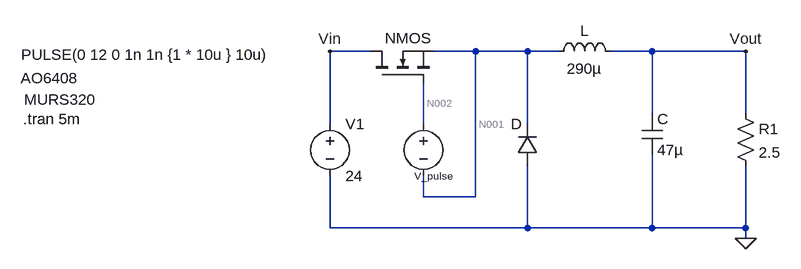
[diagram p0: schematic Buck.asc]
Buck.asc, the LTspice schematic file:
Version 4
SHEET 1 880 680
WIRE 32 32 -32 32
WIRE 192 32 128 32
WIRE 272 32 192 32
WIRE 320 32 272 32
WIRE 464 32 400 32
WIRE 608 32 464 32
WIRE 464 128 464 32
WIRE 608 128 608 32
WIRE -32 144 -32 32
WIRE 112 144 112 80
WIRE 272 144 272 32
WIRE 112 256 112 224
WIRE 192 256 192 32
WIRE 192 256 112 256
WIRE -32 304 -32 224
WIRE 272 304 272 208
WIRE 272 304 -32 304
WIRE 464 304 464 192
WIRE 464 304 272 304
WIRE 608 304 608 208
WIRE 608 304 464 304
WIRE 608 320 608 304
FLAG 608 320 0
FLAG 608 32 Vout
FLAG -32 32 Vin
SYMBOL voltage -32 128 R0
WINDOW 123 0 0 Left 0
WINDOW 39 0 0 Left 0
SYMATTR InstName V1
SYMATTR Value 24
SYMBOL voltage 112 128 R0
WINDOW 0 -14 96 Left 1
WINDOW 3 -619 -91 Left 2
WINDOW 123 0 0 Left 0
WINDOW 39 0 0 Left 0
SYMATTR InstName V_pulse
SYMATTR Value PULSE(0 12 0 1n 1n {1 * 10u } 10u)
SYMBOL nmos 32 80 R270
WINDOW 0 68 21 VRight 2
WINDOW 3 7 -540 VRight 2
SYMATTR InstName NMOS
SYMATTR Value AO6408
SYMBOL diode 288 208 R180
WINDOW 0 24 64 Left 2
WINDOW 3 680 102 Left 2
SYMATTR InstName D
SYMATTR Value MURS320
SYMBOL ind 304 48 R270
WINDOW 0 32 56 VTop 2
WINDOW 3 5 56 VBottom 2
SYMATTR InstName L
SYMATTR Value 290µ
SYMBOL cap 448 128 R0
SYMATTR InstName C
SYMATTR Value 47µ
SYMBOL res 592 112 R0
SYMATTR InstName R1
SYMATTR Value 2.5
TEXT -504 136 Left 2 !.tran 5m

The netlist it stands for:
* Buck.asc
V1 Vin 0 24
V_pulse N002 N001 PULSE(0 12 0 1n 1n {1 * 10u } 10u)
M§NMOS Vin N002 N001 N001 AO6408
D 0 N001 MURS320
L N001 Vout 290µ
C Vout 0 47µ
R1 Vout 0 2.5
.model D D
.lib standard.dio
.model NMOS NMOS
.model PMOS PMOS
.lib standard.mos
.tran 5m
.backanno
.end

* Results of the author's LTspice run, read from the files saved beside the schematic
* Operating Point, zero values left out:
*   V(vin) = 24 V
*   Id(Nmos) = 987.3 pA
*   Is(Nmos) = -987.3 pA
*   I(L) = 1.011 nA
*   I(R1) = 1.011 nA
*   I(V1) = -1.01 nA
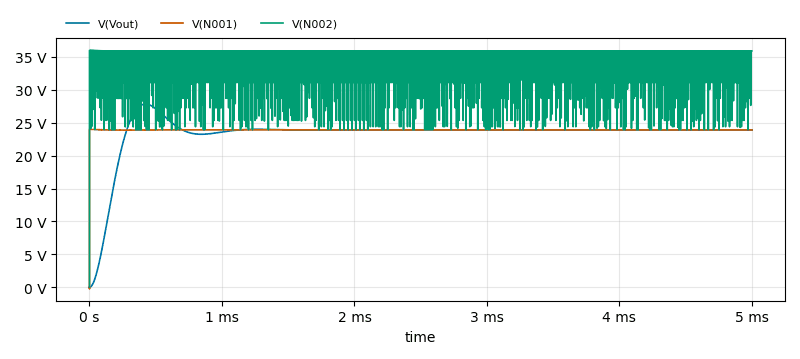
[diagram p1: Transient Analysis of Buck.asc, plotted from the saved traces]
* Transient Analysis, 1 run:
*   V(Vout): min 0 V, max 27.84 V, average 23.35 V, rms 23.62 V, last 23.9 V
*   V(N001): min -469.3 mV, max 24.01 V, average 23.91 V, rms 23.91 V, last 23.91 V
*   V(N002): min 0 V, max 36 V, average 35.91 V, rms 35.91 V, last 35.91 V